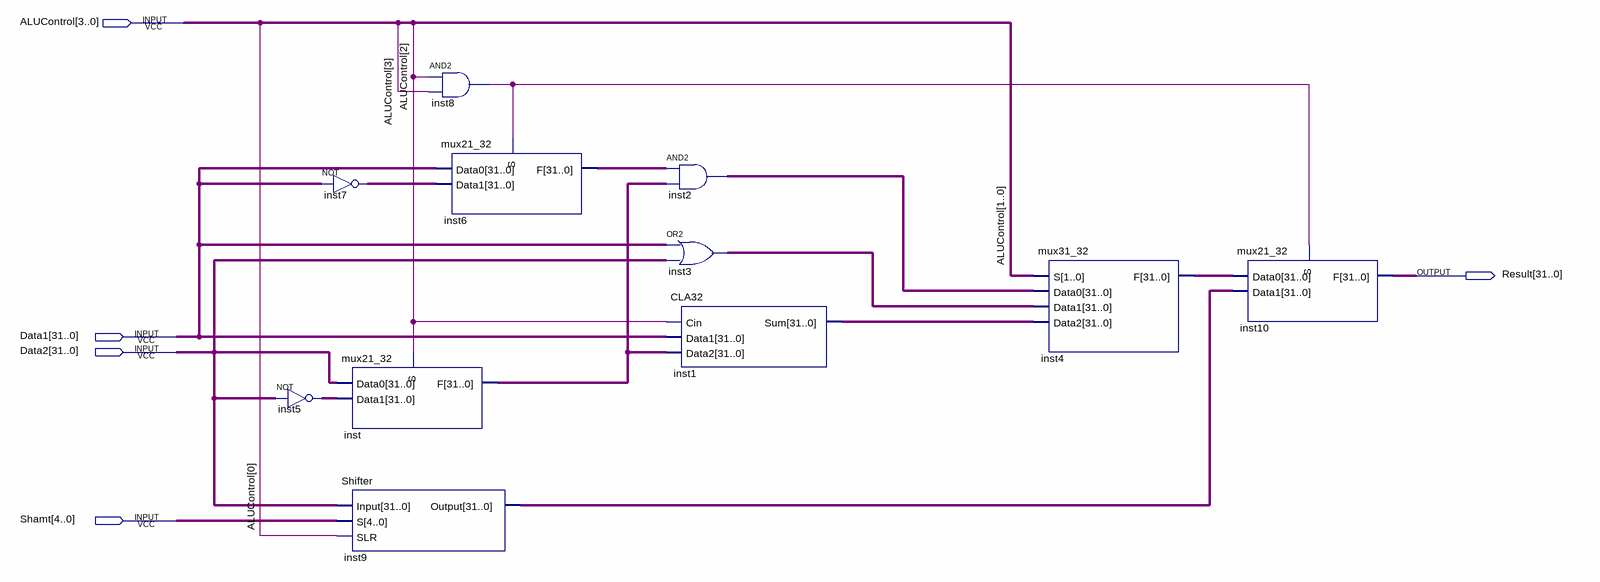
[diagram p0: schematic sheet]
// Quartus schematic temp.bdf as structural Verilog: 11 symbols, 5 pins
module temp (
  input  [3:0] ALUControl,
  input  [31:0] Data1,
  input  [31:0] Data2,
  input  [4:0] Shamt,
  output [31:0] Result
);

  wire inst8_out;
  wire [31:0] inst1_sum, inst2_out, inst3_out, inst4_f, inst5_out, inst6_f, inst7_out, inst9_output, inst_f;

  assign inst5_out = ~Data2;  // NOT inst5, 32 bits wide
  assign inst7_out = ~Data1;  // NOT inst7, 32 bits wide
  mux21_32 inst (.Data0(Data2), .Data1(inst5_out), .S(ALUControl[2]), .F(inst_f));
  Shifter inst9 (.Input(Data2), .S(Shamt), .SLR(ALUControl[0]), .Output(inst9_output));
  and inst8 (inst8_out, ALUControl[2], ALUControl[3]);
  mux21_32 inst6 (.Data0(Data1), .Data1(inst7_out), .S(inst8_out), .F(inst6_f));
  assign inst2_out = inst6_f & inst_f;  // AND2 inst2, 32 bits wide
  assign inst3_out = Data1 | Data2;  // OR2 inst3, 32 bits wide
  CLA32 inst1 (.Cin(ALUControl[2]), .Data1(Data1), .Data2(inst_f), .Sum(inst1_sum));
  mux31_32 inst4 (.S(ALUControl[1:0]), .Data0(inst2_out), .Data1(inst3_out), .Data2(inst1_sum), .F(inst4_f));
  mux21_32 inst10 (.Data0(inst4_f), .Data1(inst9_output), .S(inst8_out), .F(Result));
endmodule
